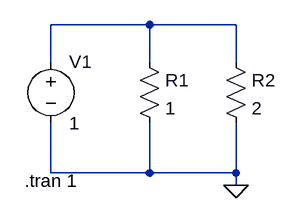
[diagram p0: schematic simple_circult_netlist.asc]
simple_circult_netlist.asc, the LTspice schematic file:
Version 4
SHEET 1 880 680
WIRE 240 0 112 0
WIRE 352 0 240 0
WIRE 112 48 112 0
WIRE 240 48 240 0
WIRE 352 48 352 0
WIRE 112 192 112 128
WIRE 240 192 240 128
WIRE 240 192 112 192
WIRE 352 192 352 128
WIRE 352 192 240 192
WIRE 352 208 352 192
FLAG 352 208 0
SYMBOL voltage 112 32 R0
WINDOW 123 0 0 Left 0
WINDOW 39 0 0 Left 0
SYMATTR InstName V1
SYMATTR Value 1
SYMBOL res 224 32 R0
SYMATTR InstName R1
SYMATTR Value 1
SYMBOL res 336 32 R0
SYMATTR InstName R2
SYMATTR Value 2
TEXT 78 202 Left 2 !.tran 1

The netlist it stands for:
* simple_circult_netlist.asc
V1 N001 0 1
R1 N001 0 1
R2 N001 0 2
.tran 1
.backanno
.end